# EAGLE schematic SDA381V5 (EAGLE 9.6.2)
Assembly variants: 75W, 150W
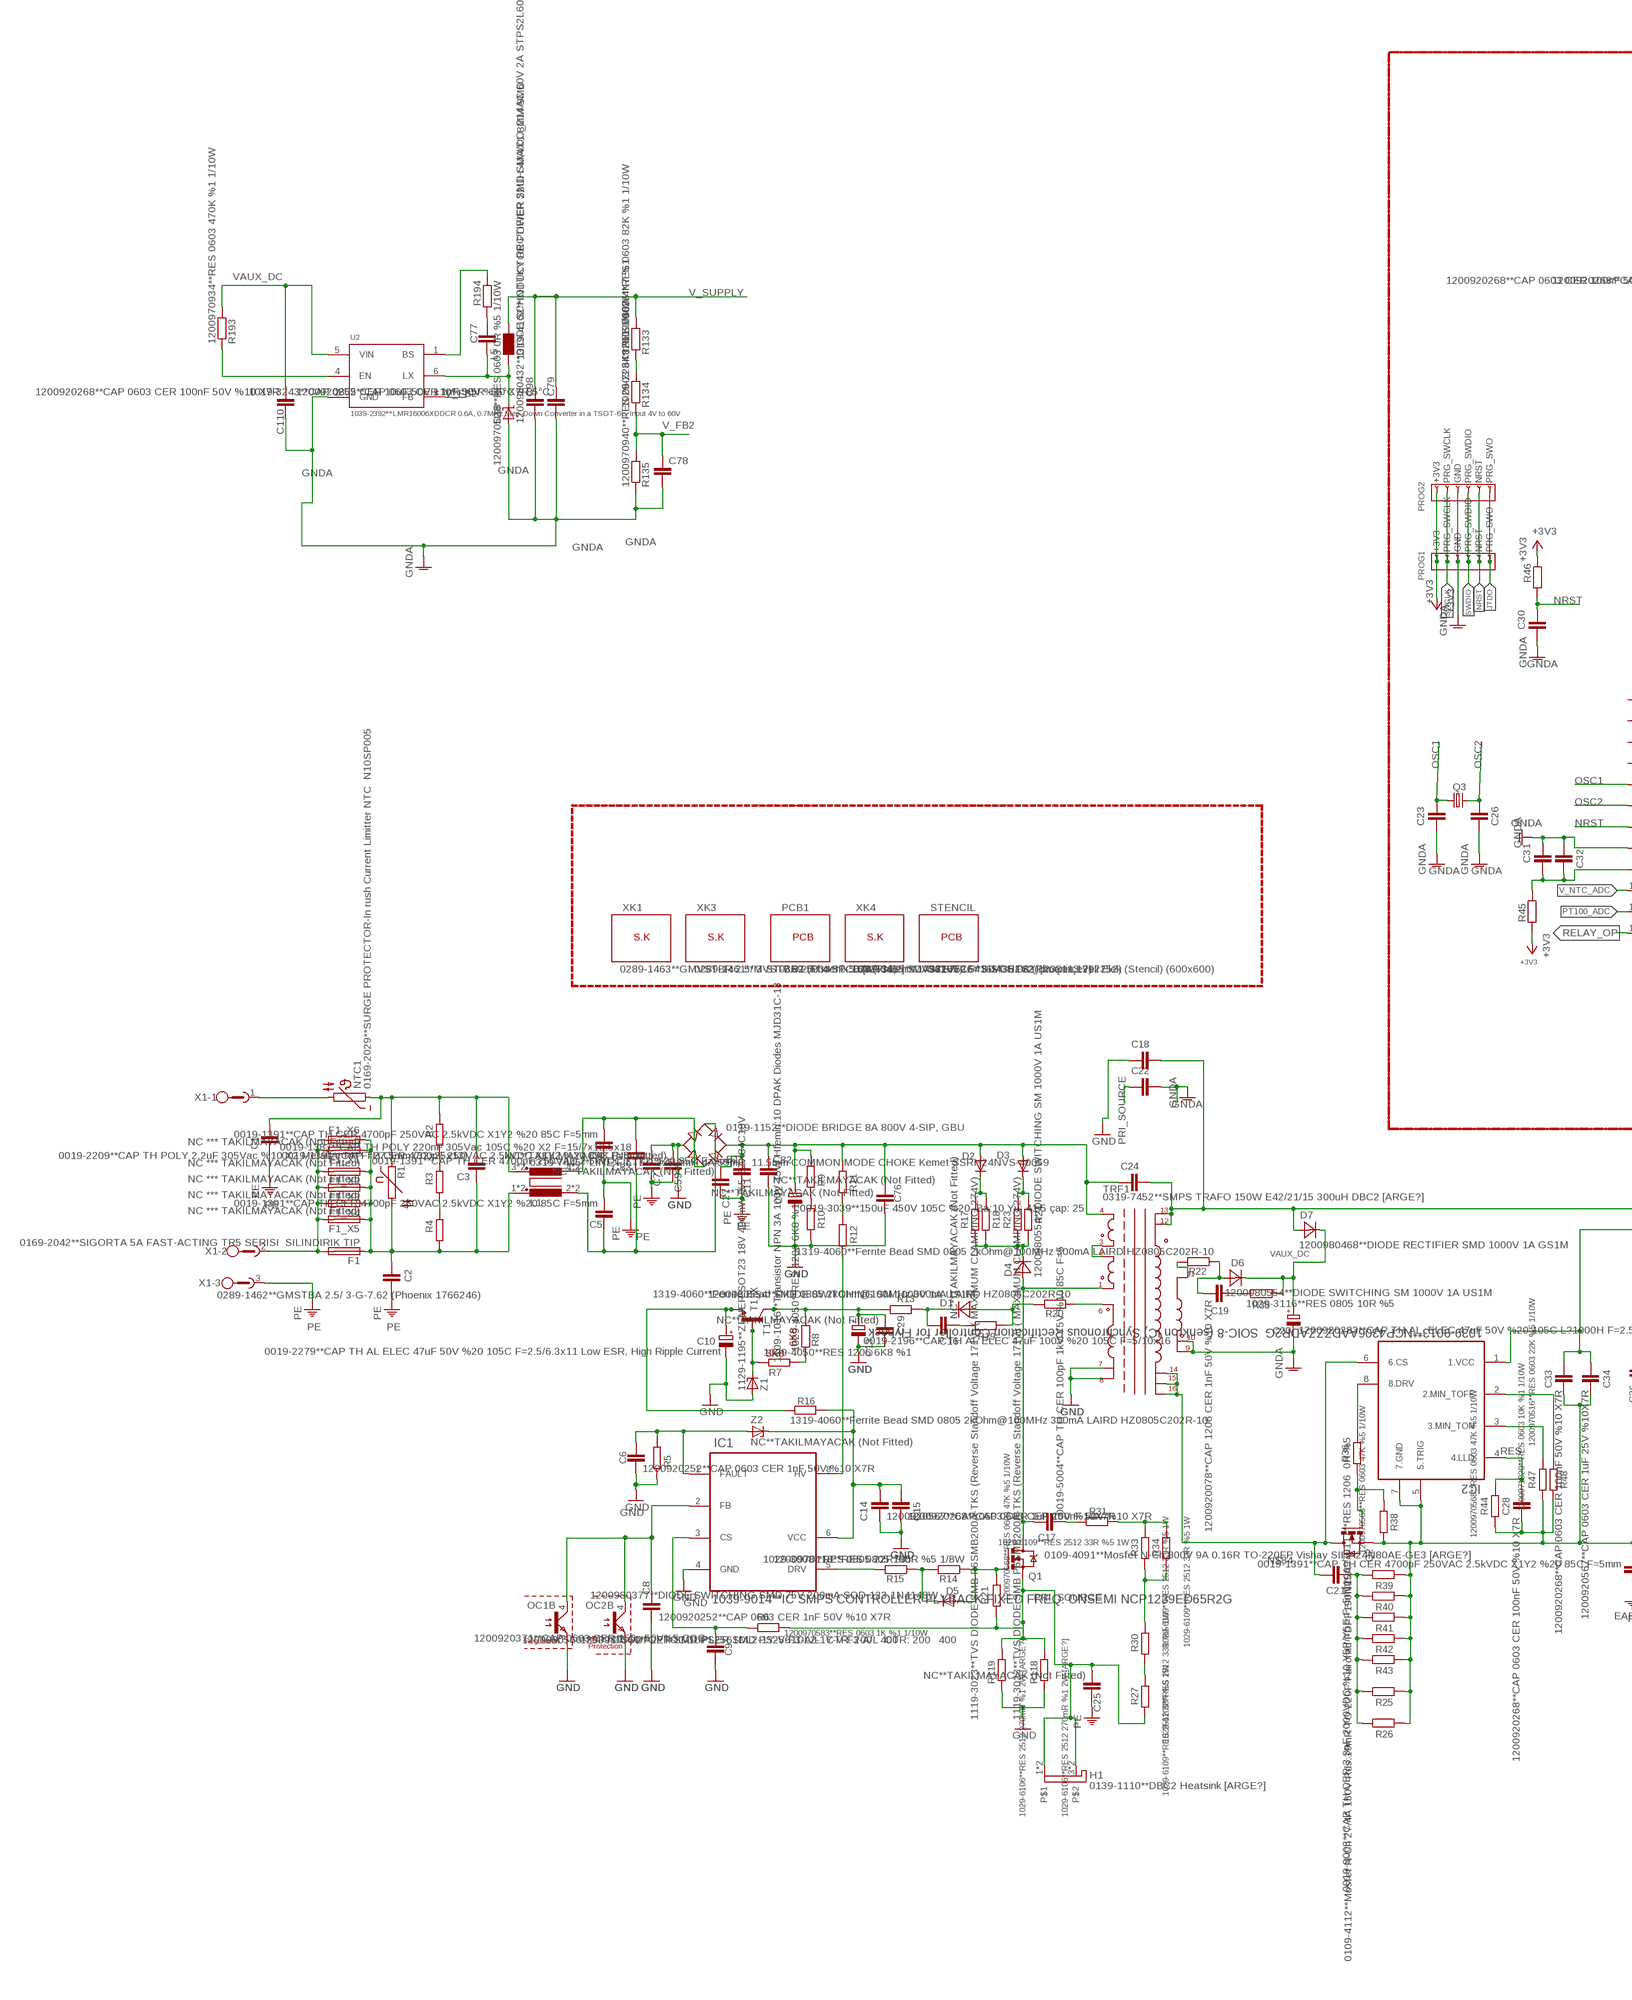
[diagram p0: schematic, sheet 1, part 1 of 2]
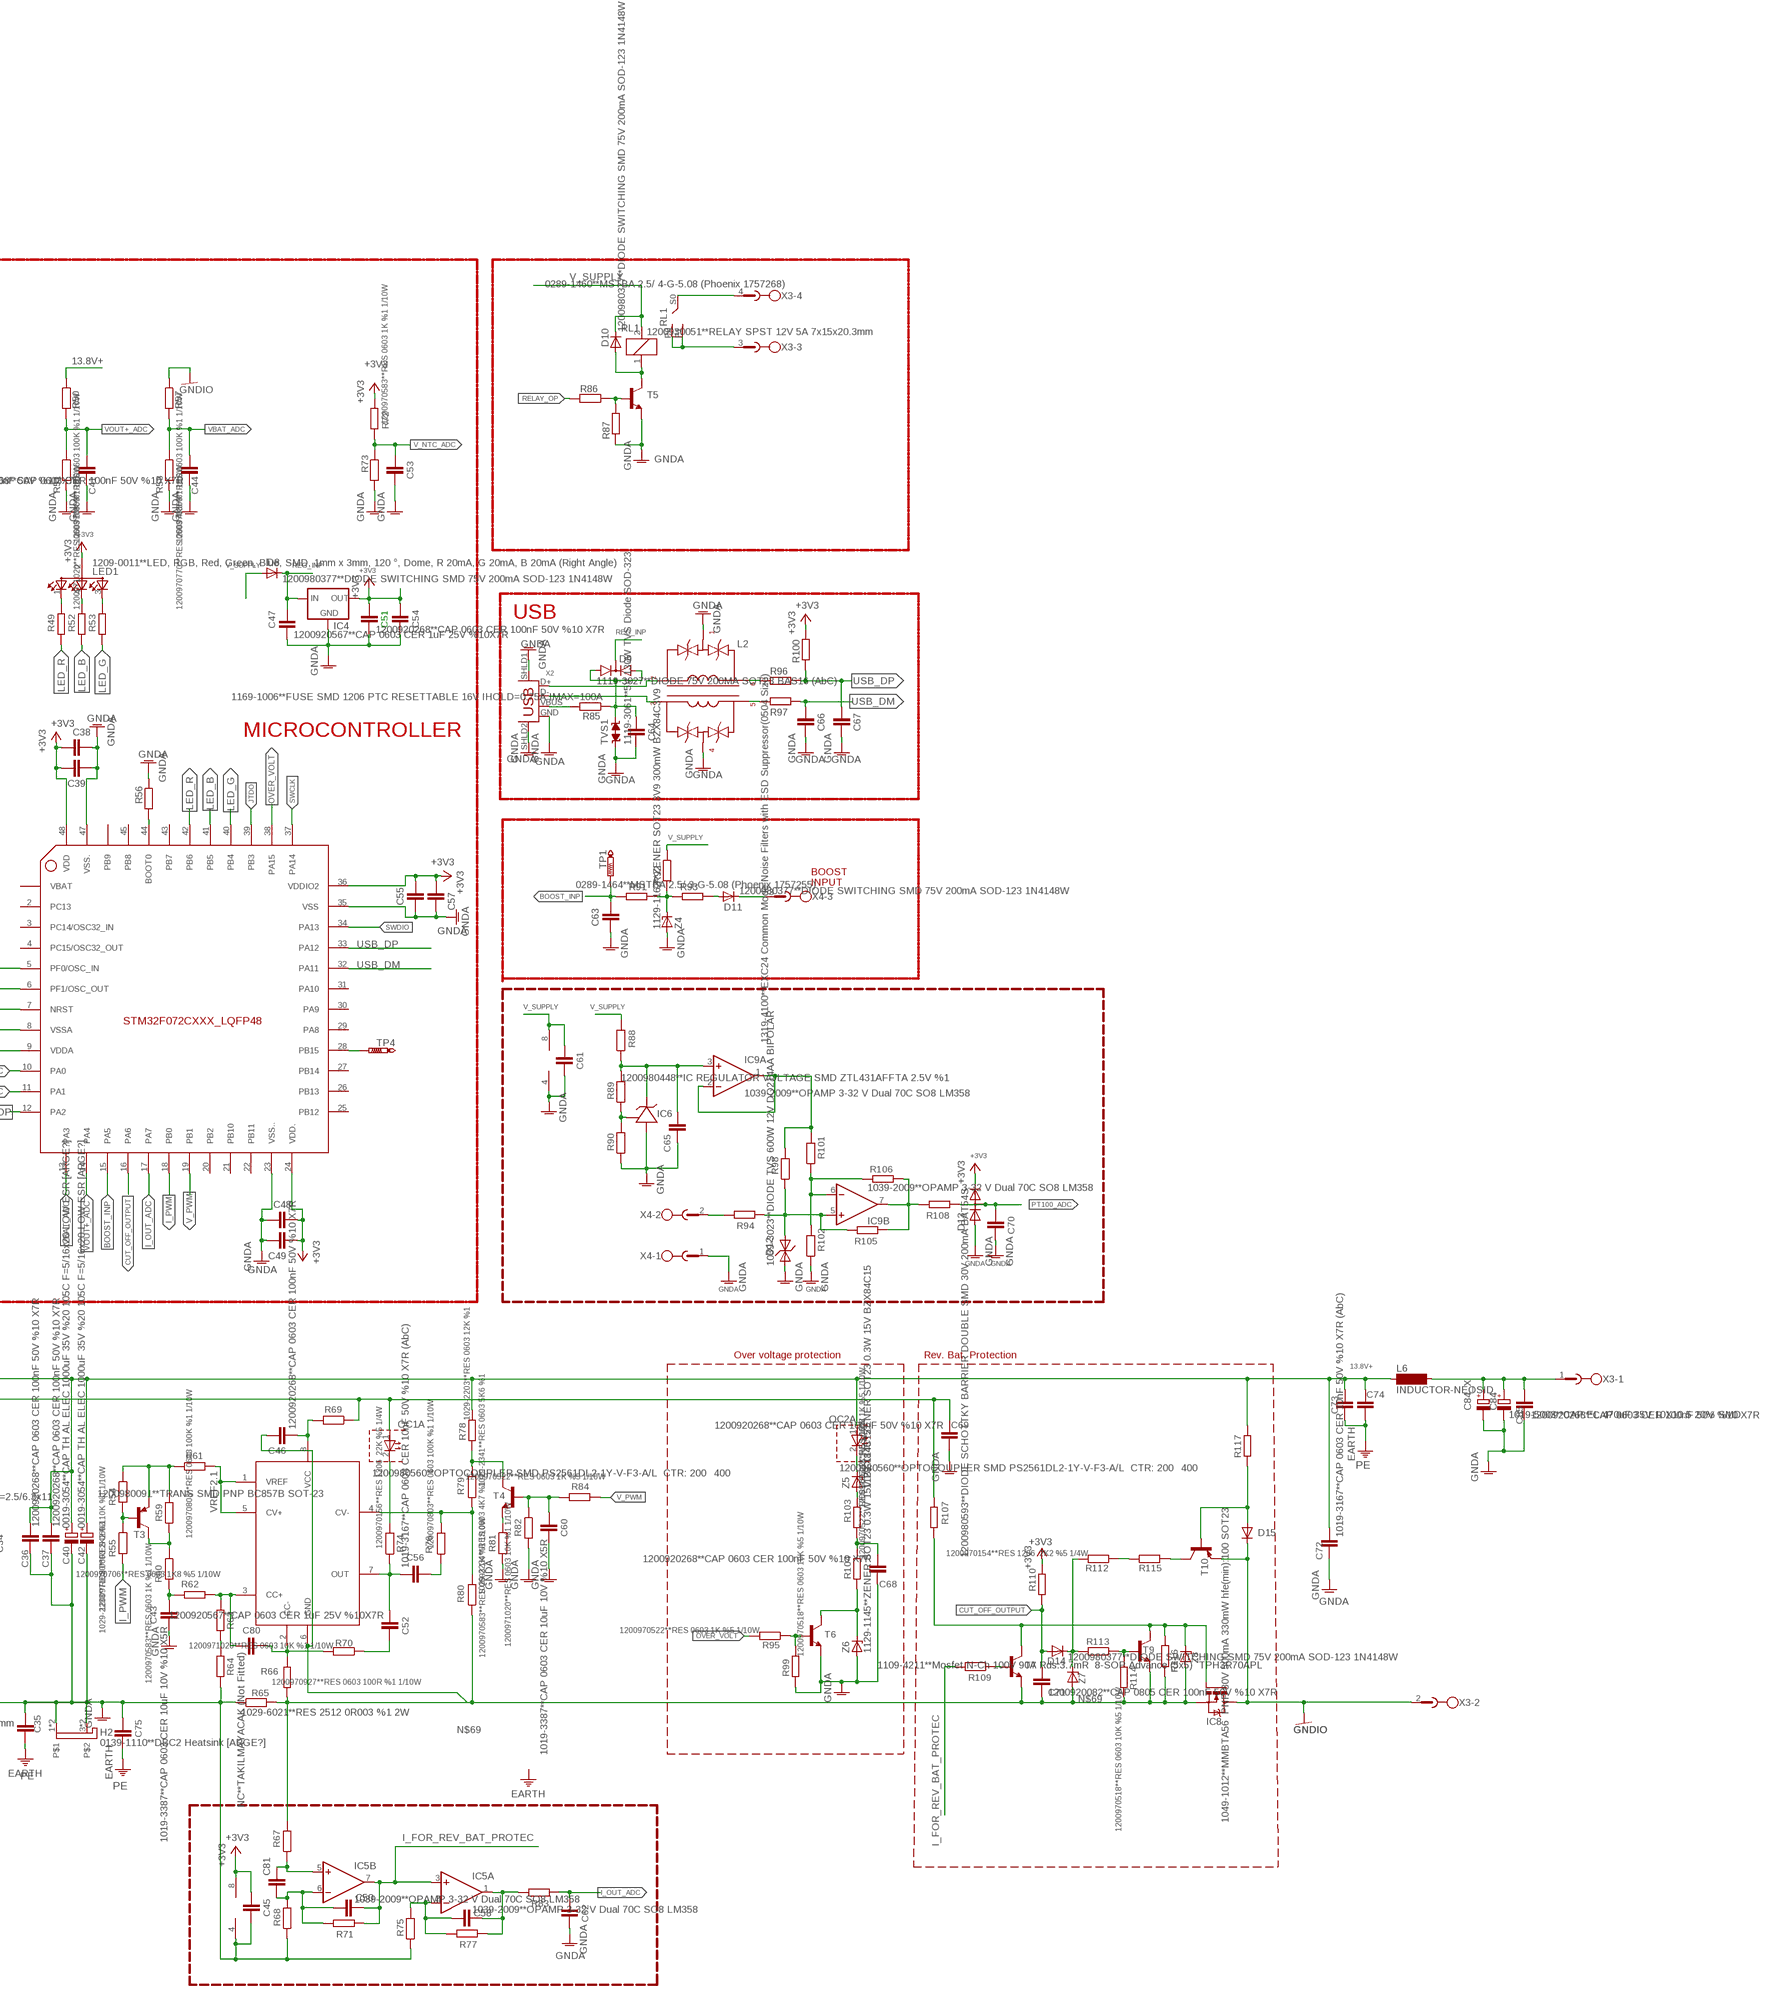
[diagram p1: schematic, sheet 1, part 2 of 2]

## Parts
B1  0119-1152**DIODE BRIDGE 8A 800V 4-SIP, GBU  DıODE_BRIDGE_8A_DIK  [DıODE_BRIDGE_8A_DIK]  (variant 75W: 0119-1171**KOPRU DIYOT MONOFAZ 4A 1000V KBL )
C1  NC**TAKILMAYACAK (Not Fitted)  C50-035X75  [C50-035X75]
C2  NC**TAKILMAYACAK (Not Fitted)  C50-035X75  [C50-035X75]
C3  0019-2209**CAP TH POLY 2.2uF 305Vac %10 X2 Metalize PP F=27.5mm (32x25x13)  C275-113X316_&_C150-072X183_&_C225-113X268  [C275-113X316_&_C150-072X183_&_C225-113X268]  (variant 75W: 0019-2207**CAP TH POLY 1uF 305Vac %10 X2 MKP F=22.5mm (12x22x26.5) )
C4  0019-1391**CAP TH CER 4700pF 250VAC 2.5kVDC X1Y2 %20 85C F=5mm  C50-035X75  [C50-035X75]  (variant 75W: 1200920292**CAP TH CER 2.2nF 300Vac %20 X1Y2 F=7.5mm DxS(13x5) )
C5  0019-1391**CAP TH CER 4700pF 250VAC 2.5kVDC X1Y2 %20 85C F=5mm  C50-035X75  [C50-035X75]  (variant 75W: 1200920292**CAP TH CER 2.2nF 300Vac %20 X1Y2 F=7.5mm DxS(13x5) )
C6  1200920252**CAP 0603 CER 1nF 50V %10 X7R  C-EUC0603E  [C0603_ENKO]  (variant 75W: 1200920252**CAP 0603 CER 1nF 50V %10 X7R )
C7  0019-1391**CAP TH CER 4700pF 250VAC 2.5kVDC X1Y2 %20 85C F=5mm  C50-035X75  [C50-035X75]  (variant 75W: 1200920292**CAP TH CER 2.2nF 300Vac %20 X1Y2 F=7.5mm DxS(13x5) )
C8  1200920252**CAP 0603 CER 1nF 50V %10 X7R  C-EUC0603E  [C0603_ENKO]  (variant 75W: 1200920252**CAP 0603 CER 1nF 50V %10 X7R )
C9  1200920371**CAP 0603 CER 150p 50V%5 COG  C-EUC0603E  [C0603_ENKO]
C10  0019-2279**CAP TH AL ELEC 47uF 50V %20 105C F=2.5/6.3x11 Low ESR, High Ripple Current  CPOL-EUE2.5-7  [E2,5-7]  (variant 75W: 0019-2279**CAP TH AL ELEC 47uF 50V %20 105C F=2.5/6.3x11 Low ESR, High Ripple Current )
C11  0019-1391**CAP TH CER 4700pF 250VAC 2.5kVDC X1Y2 %20 85C F=5mm  C50-035X75  [C50-035X75]  (variant 75W: 1200920292**CAP TH CER 2.2nF 300Vac %20 X1Y2 F=7.5mm DxS(13x5) )
C12  0019-3039**150uF 450V 105C %20 Ba:10 Yu: 41,5 çap: 25  CPOL-EUE10-25  [EB25D]  (variant 75W: 0019-3039**150uF 450V 105C %20 Ba:10 Yu: 41,5 çap: 25 )
C13  0019-2196**CAP TH AL ELEC 47uF 100V %20 105C F=5/10x16  CPOL-EUE5-10.5  [E5-10,5]
C14  1200920567**CAP 0603 CER 1uF 25V %10X7R  C-EUC0603E  [C0603_ENKO]  (variant 75W: 1200920567**CAP 0603 CER 1uF 25V %10X7R )
C15  1200920268**CAP 0603 CER 100nF 50V %10 X7R  C-EUC0603E  [C0603_ENKO]  (variant 75W: 1200920268**CAP 0603 CER 100nF 50V %10 X7R )
C16  NC**TAKILMAYACAK (Not Fitted)  C-EUC1206E  [C1206_ENKO]
C17  0019-5004**CAP TH CER 100pF 1kV Y5V %10 85C F=5  C075-32X103/C050-035X75  [C075-32X103/C050-035X75]  (variant 150W: 0019-1393**CAP TH CER 270pF 630V COG,NPO RADIAL %5 125C F=5mm )
C18  1200920292**CAP TH CER 2.2nF 300Vac %20 X1Y2 F=7.5mm DxS(13x5)  C075-32X103_DEIF  [C075-32X103_DEIF]
C19  1200920078**CAP 1206 CER 1nF 50V %10 X7R  C-EUC1206E  [C1206_ENKO]
C20  1200920283**CAP TH AL. ELEC 47uF 50V %20 105C L?1000H F=2.5/6.3x11  CPOL-EUE2.5-7  [E2,5-7]
C21  0019-3003**CAP TH CER 3.3nF 2000VDC %10 Y5P/Y5E F=5mm  C-EU050-045X075  [C050-045X075]  (variant 75W: 0019-1391**CAP TH CER 4700pF 250VAC 2.5kVDC X1Y2 %20 85C F=5mm )
C22  NC**TAKILMAYACAK (Not Fitted)  C075-32X103_DEIF  [C075-32X103_DEIF]
C23  1019-3352**CAP 0603 CER 22pF 50V %5 NPO  C-EUC0603E  [C0603_ENKO]
C24  NC**TAKILMAYACAK (Not Fitted)  C075-32X103_DEIF  [C075-32X103_DEIF]  (variant 150W: 1200920292**CAP TH CER 2.2nF 300Vac %20 X1Y2 F=7.5mm DxS(13x5) )
C25  NC**TAKILMAYACAK (Not Fitted)  C50-035X75  [C50-035X75]  (variant 150W: 0019-1391**CAP TH CER 4700pF 250VAC 2.5kVDC X1Y2 %20 85C F=5mm)
C26  1019-3352**CAP 0603 CER 22pF 50V %5 NPO  C-EUC0603E  [C0603_ENKO]
C27  NC**TAKILMAYACAK (Not Fitted)  C50-035X75  [C50-035X75]
C28  1200920268**CAP 0603 CER 100nF 50V %10 X7R  C-EUC0603E  [C0603_ENKO]
C29  NC**TAKILMAYACAK (Not Fitted)  C-EUC1206E  [C1206_ENKO]
C30  1200920268**CAP 0603 CER 100nF 50V %10 X7R  C-EUC0603E  [C0603_ENKO]
C31  1200920268**CAP 0603 CER 100nF 50V %10 X7R  C-EUC0603E  [C0603_ENKO]
C32  1019-3167**CAP 0603 CER 10nF 50V %10 X7R (AbC)  C-EUC0603E  [C0603_ENKO]
C33  1200920268**CAP 0603 CER 100nF 50V %10 X7R  C-EUC0603E  [C0603_ENKO]
C34  1200920567**CAP 0603 CER 1uF 25V %10X7R  C-EUC0603E  [C0603_ENKO]  (variant 75W: 1200920567**CAP 0603 CER 1uF 25V %10X7R )
C35  0019-1391**CAP TH CER 4700pF 250VAC 2.5kVDC X1Y2 %20 85C F=5mm  C-EU050-045X075  [C050-045X075]  (variant 75W: 0019-1391**CAP TH CER 4700pF 250VAC 2.5kVDC X1Y2 %20 85C F=5mm )
C36  1200920268**CAP 0603 CER 100nF 50V %10 X7R  C-EUC0603E  [C0603_ENKO]
C37  1200920268**CAP 0603 CER 100nF 50V %10 X7R  C-EUC0603E  [C0603_ENKO]
C38  1200920268**CAP 0603 CER 100nF 50V %10 X7R  C-EUC0603E  [C0603_ENKO]
C39  1019-3167**CAP 0603 CER 10nF 50V %10 X7R (AbC)  C-EUC0603E  [C0603_ENKO]
C40  0019-3054**CAP TH AL ELEC 1000uF 35V %20 105C F=5/16x20 LOW ESR [ARGE?]  E5-13/E7,5-16  [E5-13/E7,5-16]
C41  1200920268**CAP 0603 CER 100nF 50V %10 X7R  C-EUC0603E  [C0603_ENKO]
C42  0019-3054**CAP TH AL ELEC 1000uF 35V %20 105C F=5/16x20 LOW ESR [ARGE?]  CPOL-EUE5-13  [E5-13]
C43  1019-3387**CAP 0603 CER 10uF 10V %10 X5R  C-EUC0603E  [C0603_ENKO]
C44  1200920268**CAP 0603 CER 100nF 50V %10 X7R  C-EUC0603E  [C0603_ENKO]
C45  1200920268**CAP 0603 CER 100nF 50V %10 X7R  C-EUC0603E  [C0603_ENKO]
C46  1200920268**CAP 0603 CER 100nF 50V %10 X7R  C-EUC0603E  [C0603_ENKO]
C47  1200920567**CAP 0603 CER 1uF 25V %10X7R  C-EUC0603E  [C0603_ENKO]  (variant 75W: 1200920567**CAP 0603 CER 1uF 25V %10X7R )
C48  1019-3167**CAP 0603 CER 10nF 50V %10 X7R (AbC)  C-EUC0603E  [C0603_ENKO]
C49  1200920268**CAP 0603 CER 100nF 50V %10 X7R  C-EUC0603E  [C0603_ENKO]
C50  NC**TAKILMAYACAK (Not Fitted)  C-EUC0603E  [C0603_ENKO]
C51  1200920268**CAP 0603 CER 100nF 50V %10 X7R  C-EUC0603E  [C0603_ENKO]
C52  1200920567**CAP 0603 CER 1uF 25V %10X7R  C-EUC0603E  [C0603_ENKO]  (variant 75W: 1200920567**CAP 0603 CER 1uF 25V %10X7R )
C53  1200920268**CAP 0603 CER 100nF 50V %10 X7R  C-EUC0603E  [C0603_ENKO]
C54  1019-3301**CAP 0805 47uF 6.3V %20 X5R  C-EUC0805E  [C0805_ENKO]
C55  1019-3167**CAP 0603 CER 10nF 50V %10 X7R (AbC)  C-EUC0603E  [C0603_ENKO]
C56  1019-3167**CAP 0603 CER 10nF 50V %10 X7R (AbC)  C-EUC0603E  [C0603_ENKO]  (variant 75W: 1200920268**CAP 0603 CER 100nF 50V %10 X7R)
C57  1200920268**CAP 0603 CER 100nF 50V %10 X7R  C-EUC0603E  [C0603_ENKO]
C58  1200920371**CAP 0603 CER 150p 50V%5 COG  C-EUC0603E  [C0603_ENKO]
C59  NC**TAKILMAYACAK (Not Fitted)  C50-035X75  [C50-035X75]  (variant 150W: 0019-1391**CAP TH CER 4700pF 250VAC 2.5kVDC X1Y2 %20 85C F=5mm)
C60  1019-3387**CAP 0603 CER 10uF 10V %10 X5R  C-EUC0603E  [C0603_ENKO]
C61  1200920268**CAP 0603 CER 100nF 50V %10 X7R  C-EUC0603E  [C0603_ENKO]
C62  1200920268**CAP 0603 CER 100nF 50V %10 X7R  C-EUC0603E  [C0603_ENKO]
C63  1019-3167**CAP 0603 CER 10nF 50V %10 X7R (AbC)  C-EUC0603E  [C0603_ENKO]
C64  1200920268**CAP 0603 CER 100nF 50V %10 X7R  C-EUC0603E  [C0603_ENKO]
C65  1200920268**CAP 0603 CER 100nF 50V %10 X7R  C-EUC0603E  [C0603_ENKO]
C66  1019-3381**CAP 0603 CER 33pf 50V %5 NPO(COG)  C-EUC0603E  [C0603_ENKO]
C67  1019-3381**CAP 0603 CER 33pf 50V %5 NPO(COG)  C-EUC0603E  [C0603_ENKO]
C68  1200920268**CAP 0603 CER 100nF 50V %10 X7R  C-EUC0603E  [C0603_ENKO]
C69  1200920268**CAP 0603 CER 100nF 50V %10 X7R  C-EUC0603E  [C0603_ENKO]
C70  1200920268**CAP 0603 CER 100nF 50V %10 X7R  C-EUC0603E  [C0603_ENKO]
C71  1200920082**CAP 0805 CER 100nF 50V %10 X7R  C-EUC0805E  [C0805_ENKO]
C72  1019-3167**CAP 0603 CER 10nF 50V %10 X7R (AbC)  C-EUC0603E  [C0603_ENKO]
C73  0019-1391**CAP TH CER 4700pF 250VAC 2.5kVDC X1Y2 %20 85C F=5mm  C-EU050-035X075  [C050-035X075]  (variant 75W: 0019-1391**CAP TH CER 4700pF 250VAC 2.5kVDC X1Y2 %20 85C F=5mm )
C74  NC**TAKILMAYACAK (Not Fitted)  C-EU050-035X075  [C050-035X075]  (variant 75W: 0019-1391**CAP TH CER 4700pF 250VAC 2.5kVDC X1Y2 %20 85C F=5mm )
C75  NC**TAKILMAYACAK (Not Fitted)  C-EU050-035X075  [C050-035X075]  (variant 75W: 0019-1391**CAP TH CER 4700pF 250VAC 2.5kVDC X1Y2 %20 85C F=5mm )
C76  NC**TAKILMAYACAK (Not Fitted)  C065-052X106  [C065-052X106]  (variant 150W: 0019-1391**CAP TH CER 4700pF 250VAC 2.5kVDC X1Y2 %20 85C F=5mm)
C77  1200920268**CAP 0603 CER 100nF 50V %10 X7R  C-EUC0603E  [C0603_ENKO]
C78  1200920271**CAP 0603 CER 10pF 50V%10 COG  C-EUC0603E  [C0603_ENKO]
C79  1019-3243**CAP 0805 CER 10uF 50V ±10% X5R -55°C ~ 85°C  C-EUC0805E  [C0805_ENKO]
C80  NC**TAKILMAYACAK (Not Fitted)  C-EUC0603E  [C0603_ENKO]
C81  NC**TAKILMAYACAK (Not Fitted)  C-EUC0603E  [C0603_ENKO]
C82  NC**TAKILMAYACAK (Not Fitted)  C-EU150-091X182  [C150-091X182]
C83  0019-1383**CAP TH POLY 220nF 305Vac 105C %20 X2 F=15/7x13.5x18  C150-091X182_C225-108X268  [C150-091X182_C225-108X268]
C84  1019-5003**CAP.EL.470uF 35V 10X10.5 20% SMD  CPOL-EUE5-10.5  [E5-10,5]
C84_X  CPOL-EUE2.5-7  [E2,5-7]
C85  1200920268**CAP 0603 CER 100nF 50V %10 X7R  C-EUC0603E  [C0603_ENKO]
C98  1200920252**CAP 0603 CER 1nF 50V %10 X7R  C-EUC0603E  [C0603_ENKO]
C110  1200920268**CAP 0603 CER 100nF 50V %10 X7R  C-EUC0603E  [C0603_ENKO]
D1  1200980554**DIODE SWITCHING SM 1000V 1A US1M  M7_DC_DIYOT  [M7_DC_DIYOT]
D2  1119-3023**TVS DIODE SMB P6SMB200A-TKS (Reverse Standoff Voltage 171V) ( MAXIMUM CLAMPING 274V)  DIODE-SMB  [SMB]  (variant 75W: 0119-4002**TVS DIODE SMB 600W 160V (Reverse Standoff Voltage 136V) ( MAXIMUM CLAMPING VOLTAGE 219V) )
D3  1119-3023**TVS DIODE SMB P6SMB200A-TKS (Reverse Standoff Voltage 171V) ( MAXIMUM CLAMPING 274V)  DIODE-SMB  [SMB]  (variant 75W: 0119-4002**TVS DIODE SMB 600W 160V (Reverse Standoff Voltage 136V) ( MAXIMUM CLAMPING VOLTAGE 219V) )
D4  1200980554**DIODE SWITCHING SM 1000V 1A US1M  M7_DC_DIYOT  [M7_DC_DIYOT]
D5  1200980377**DIODE SWITCHING SMD 75V 200mA SOD-123 1N4148W  DIODE-SOD123  [SOD123]  (variant 75W: NC**AKILMAYACAK (Not Fitted))  (variant 150W: 1200980377**DIODE SWITCHING SMD 75V 200mA SOD-123 1N4148W )
D6  1200980554**DIODE SWITCHING SM 1000V 1A US1M  M7_DC_DIYOT  [M7_DC_DIYOT]
D7  1200980468**DIODE RECTIFIER SMD 1000V 1A GS1M  M7_DC_DIYOT  [M7_DC_DIYOT]
D8  1200980377**DIODE SWITCHING SMD 75V 200mA SOD-123 1N4148W  DIODE-SOD123  [SOD123]
D9  1119-3027**DIODE 75V 200MA SOT23 BAS16 (AbC)  DIODE-2AC|CASOT23  [SOT23]
D10  1200980377**DIODE SWITCHING SMD 75V 200mA SOD-123 1N4148W  DIODE-SOD123  [SOD123]
D11  1200980377**DIODE SWITCHING SMD 75V 200mA SOD-123 1N4148W  DIODE-SOD123  [SOD123]
D12  1039-3023**DIODE TVS 600W 12V DO214AA BIPOLAR  TRANSIL_SMB  [TRANSIL_SMB]
D13  1200980593**DIODE SCHOTTKY BARRIER DOUBLE SMD 30V 200mA BAT54S  BAV199  [SOT23]
D14  1200980377**DIODE SWITCHING SMD 75V 200mA SOD-123 1N4148W  DIODE-SOD123  [SOD123]
D15  1200980377**DIODE SWITCHING SMD 75V 200mA SOD-123 1N4148W  DIODE-SOD123  [SOD123]
D18  1200980432**DIODE SCHOTTKY RECTIFIER SMD SMA/DO_214AC 60V 2A STPS2L60A  SD-SMA  [SMA]
F1  0169-2042**SIGORTA 5A FAST-ACTING TR5 SERISI SILINDIRIK TIP  SENS_FUSE  [SENS_FUSE]
F1_X1  NC *** TAKILMAYACAK (Not Fitted)  FUSE_0678D  [FUSE_0678D]
F1_X2  NC *** TAKILMAYACAK (Not Fitted)  FUSE_1025FA  [FUSE_1025FA]
F1_X3  NC *** TAKILMAYACAK (Not Fitted)  FUSE_EBF_FUSE_446/447  [FUSE_EBF_FUSE_446/447]
F1_X4  NC *** TAKILMAYACAK (Not Fitted)  FUSE_OMF250  [FUSE_OMF250]
F1_X5  NC *** TAKILMAYACAK (Not Fitted)  FUSE_UMF250  [FUSE_UMF250]
F1_X6  FUSE_TYPE0679H  [FUSE_TYPE0679H]
H1  0139-1110**DBC2 Heatsink [ARGE?]  DEIF_SOGUTUCU_2  [DEIF_SOGUTUCU_2]
H2  0139-1110**DBC2 Heatsink [ARGE?]  DEIF_SOGUTUCU_2  [DEIF_SOGUTUCU_2]
IC1  1039-9014**IC SMPS CONTROLLER FLYBACK FIXED FREQ. ONSEMI NCP1239ED65R2G  NCP1239_SMPS_IC  [NCP1239_SMPS_IC]
IC2  1039-9013**NCP4306AADZZZADR2G SOIC-8 (senkron IC) Synchronous Rectification Controller for Flyback  NCP4306  [NCP4306]
IC3  1039-2224**TSM1011ID SO-8 Constant Voltage and Constant Current Controller  TSM1011  [SO-8]
IC4  1039-3003**Voltage Regulator SOT-89 3.3V Diodes AP2204RA-3.3TRG1  S-812XSGUP  [SOT89]
IC5  1039-2009**OPAMP 3-32 V Dual 70C SO8 LM358  LM358D  [SO08]
IC6  1200980448**IC REGULATOR VOLTAGE SMD ZTL431AFFTA 2.5V %1  TL431_SOT23F  [TL431_SOT23F]
IC8  1109-4211**Mosfet N-Ch 100V 90A Rds:3.7mR 8-SOP Advance (5x5) TPH3R70APL  TPH6R30ANL  [TPH6R30ANL]
IC9  1039-2009**OPAMP 3-32 V Dual 70C SO8 LM358  LM358D  [SO08]
L1  0319-7445**LINE FILTER 2x5,9mH 4A 55mR 11.5mm COMMON MODE CHOKE Kemet SSRH24NVS-40059  UU1620_&_FWCMET24V  [UU1620_&_FWCMET24V]  (variant 75W: 0319-5030**LINE FILTER 2x7mH 1,5A COMMON MODE CHOKE (UU1620) )
L2  1319-4100**EXC24 Common Mode Noise Filters with ESD Suppressor(0504 Size)  EXC24CS_COMMON_MODE  [EXC24CS_COMMON_MODE]
L5  1319-4102**INDUCTOR POWER 22UH 4X4X1.8MM SMD  WE-PD2WE_PD2_5MM  [WE-PD2_5MM]
L6  INDUCTOR-NEOSID  [INDUCTOR-NEOSID]
LED1  1209-0011**LED, RGB, Red, Green, Blue, SMD, 1mm x 3mm, 120 °, Dome, R 20mA, G 20mA, B 20mA (Right Angle)  KPFA-3010RGBC-11  [KPFA-3010RGBC-11]
NTC1  0169-2029**SURGE PROTECTOR-In rush Current Limitter NTC N10SP005  NTC_15R_2A_&_N15SP005-5  [NTC_15R_2A_&_N15SP005-5]
OC1  1200980560**OPTOCOUPLER SMD PS2561DL2-1Y-V-F3-A/L CTR: 200˜400  PS2561DL2-1_OPTO1  [PS2561DL2-1_OPTO1]
OC2  1200980560**OPTOCOUPLER SMD PS2561DL2-1Y-V-F3-A/L CTR: 200˜400  PS2561DL2-1_OPTO1  [PS2561DL2-1_OPTO1]
PCB1  0369-5034**PCB [ARGE?] SDA381V2CF416M3HFS2(123x113.2)  PCB  [PCB]
PROG1  NC**TAKILMAYACAK (Not Fitted)  PROG_6PIN  [PROG_6PIN]
PROG2  NC**TAKILMAYACAK (Not Fitted)  PROG_6PIN  [PROG_6PIN]
Q1  0109-4091**Mosfet N-Ch 800V 9A 0.16R TO-220FP Vishay SIHA24N80AE-GE3 [ARGE?]  STP5NA50  [TO220BV]
Q2  0109-4112**Mosfet N-Ch 27.4A 150V Rds:19mR TO-220F Fairchild FDPF190N15A  STP5NA50  [TO220BV]
Q3  1149-0006**HC49S SMD KRISTAL 8MHZ -40+85 20PF 50PPM FAT Y3MM  CRYSTALHC49UP  [HC49UP]
R1  0169-2013**Varistor 20mm 300V  S20K40  [S20K40]
R2  1200970587**RES 1206 470K %5 1/4W  R-EU_R1206E  [R1206_ENKO]
R3  1200970587**RES 1206 470K %5 1/4W  R-EU_R1206E  [R1206_ENKO]
R4  1200970587**RES 1206 470K %5 1/4W  R-EU_R1206E  [R1206_ENKO]
R5  1200970687**RES 0603 56K %1 1/10W  R-EU_R0603E  [R0603_ENKO]
R6  1200970583**RES 0603 1K %1 1/10W  R-EU_R0603E  [R0603_ENKO]
R7  1029-4050**RES 1206 6K8 %1  R-EU_R1206E  [R1206_ENKO]
R8  1029-4050**RES 1206 6K8 %1  R-EU_R1206E  [R1206_ENKO]
R9  1200970179**RES 1206 330K %5 1/4W  R-EU_R1206E  [R1206_ENKO]  (variant 75W: NC**TAKILMAYACAK (Not Fitted))
R10  1200970179**RES 1206 330K %5 1/4W  R-EU_R1206E  [R1206_ENKO]  (variant 75W: NC**TAKILMAYACAK (Not Fitted))
R11  1200970154**RES 1206 2K2 %5 1/4W  R-EU_R1206E  [R1206_ENKO]
R12  1200970154**RES 1206 2K2 %5 1/4W  R-EU_R1206E  [R1206_ENKO]
R13  1200970601**RES 1206 10R %5 1/4W  R-EU_R1206E  [R1206_ENKO]
R14  1200970118**RES 0805 100R %5 1/8W  R-EU_R0805E  [R0805_ENKO]  (variant 150W: 1029-6071**RES 0805 82R %1)
R15  1029-3008**RES 0805 22R %5  R-EU_R0805E  [R0805_ENKO]  (variant 150W: 1029-3416**RES 0805 47R %1 (AbC) (MX322))
R16  1319-4060**Ferrite Bead SMD 0805 2kOhm@100MHz 300mA LAIRD HZ0805C202R-10  R-EU_R0805E  [R0805_ENKO]
R17  1029-3146**RES 1206 7R68 %1  R-EU_R1206E  [R1206_ENKO]
R18  1029-3146**RES 1206 7R68 %1  R-EU_R1206E  [R1206_ENKO]
R19  NC**TAKILMAYACAK (Not Fitted)  R-EU_R1206E  [R1206_ENKO]
R20  1319-4060**Ferrite Bead SMD 0805 2kOhm@100MHz 300mA LAIRD HZ0805C202R-10  R-EU_R0805E  [R0805_ENKO]
R21  1200970568**RES 0603 47K %5 1/10W  R-EU_R0603E  [R0603_ENKO]
R22  1319-4060**Ferrite Bead SMD 0805 2kOhm@100MHz 300mA LAIRD HZ0805C202R-10  R-EU_R0805E  [R0805_ENKO]
R23  1029-3146**RES 1206 7R68 %1  R-EU_R1206E  [R1206_ENKO]
R24  1029-3146**RES 1206 7R68 %1  R-EU_R1206E  [R1206_ENKO]
R25  1200970228**RES 1206 47R %5 1/4W  R-EU_R1206E  [R1206_ENKO]
R26  1200970228**RES 1206 47R %5 1/4W  R-EU_R1206E  [R1206_ENKO]
R27  1029-6109**RES 2512 33R %5 1W  R-EU_R2512  [R2512]
R30  1029-6109**RES 2512 33R %5 1W  R-EU_R2512  [R2512]  (variant 150W: 1029-6114**RES 2512 15R %5 1W)
R31  1029-6109**RES 2512 33R %5 1W  R-EU_R2512  [R2512]  (variant 150W: 1029-6114**RES 2512 15R %5 1W)
R33  1029-6109**RES 2512 33R %5 1W  R-EU_R2512  [R2512]  (variant 150W: 1029-6114**RES 2512 15R %5 1W)
R34  1029-6109**RES 2512 33R %5 1W  R-EU_R2512  [R2512]  (variant 150W: 1029-6114**RES 2512 15R %5 1W)
R35  1029-3116**RES 0805 10R %5  R-EU_R0805E  [R0805_ENKO]
R36  1200970117**RES 1206 0R %5  R-EU_R1206E  [R1206_ENKO]
R38  1200970568**RES 0603 47K %5 1/10W  R-EU_R0603E  [R0603_ENKO]
R39  1200970228**RES 1206 47R %5 1/4W  R-EU_R1206E  [R1206_ENKO]  (variant 75W: 1200970119**RES 1206 100R %5 1/4W)  (variant 150W: NC**TAKILMAYACAK (Not Fitted) )
R40  1200970228**RES 1206 47R %5 1/4W  R-EU_R1206E  [R1206_ENKO]  (variant 75W: 1200970119**RES 1206 100R %5 1/4W)  (variant 150W: 1200970554**RES 1206 56R %1 1/4W)
R41  1200970228**RES 1206 47R %5 1/4W  R-EU_R1206E  [R1206_ENKO]  (variant 75W: 1200970119**RES 1206 100R %5 1/4W)  (variant 150W: 1200970554**RES 1206 56R %1 1/4W)
R42  1200970228**RES 1206 47R %5 1/4W  R-EU_R1206E  [R1206_ENKO]  (variant 75W: 1200970119**RES 1206 100R %5 1/4W)  (variant 150W: 1200970554**RES 1206 56R %1 1/4W)
R43  1200970228**RES 1206 47R %5 1/4W  R-EU_R1206E  [R1206_ENKO]  (variant 75W: 1200970228**RES 1206 47R %5 1/4W)  (variant 150W: 1200970554**RES 1206 56R %1 1/4W)
R44  1200970568**RES 0603 47K %5 1/10W  R-EU_R0603E  [R0603_ENKO]
R45  1319-4060**Ferrite Bead SMD 0805 2kOhm@100MHz 300mA LAIRD HZ0805C202R-10  R-EU_R0805E  [R0805_ENKO]
R46  1200970518**RES 0603 10K %5 1/10W  R-EU_R0603E  [R0603_ENKO]
R47  1200971020**RES 0603 10K %1 1/10W  R-EU_R0603E  [R0603_ENKO]
R48  1200970516**RES 0603 22K %5 1/10W  R-EU_R0603E  [R0603_ENKO]  (variant 75W: 1200970516**RES 0603 22K %5 1/10W)
R49  1029-2005**RES 0603 220R %1  R-EU_R0603E  [R0603_ENKO]
R50  1200970803**RES 0603 100K %1 1/10W  R-EU_R0603E  [R0603_ENKO]
R51  1200971020**RES 0603 10K %1 1/10W  R-EU_R0603E  [R0603_ENKO]
R52  1029-2005**RES 0603 220R %1  R-EU_R0603E  [R0603_ENKO]
R53  1029-2005**RES 0603 220R %1  R-EU_R0603E  [R0603_ENKO]
R54  1200971020**RES 0603 10K %1 1/10W  R-EU_R0603E  [R0603_ENKO]
R55  1029-2233**RES 0603 2K2 %1  R-EU_R0603E  [R0603_ENKO]
R56  1200970522**RES 0603 1K %5 1/10W  R-EU_R0603E  [R0603_ENKO]
R57  1200970803**RES 0603 100K %1 1/10W  R-EU_R0603E  [R0603_ENKO]
R58  1200970770**RES 0603 4K3 %1 1/10W  R-EU_R0603E  [R0603_ENKO]
R59  1200970803**RES 0603 100K %1 1/10W  R-EU_R0603E  [R0603_ENKO]
R60  1200970583**RES 0603 1K %1 1/10W  R-EU_R0603E  [R0603_ENKO]
R61  1200970583**RES 0603 1K %1 1/10W  R-EU_R0603E  [R0603_ENKO]
R62  1200970706**RES 0603 1K8 %5 1/10W  R-EU_R0603E  [R0603_ENKO]
R63  1029-2003**RES 0603 10R %1  R-EU_R0603E  [R0603_ENKO]  (variant 75W: 1200970927**RES 0603 100R %1 1/10W )
R64  1029-2006**RES 0603 47R %1  R-EU_R0603E  [R0603_ENKO]  (variant 75W: 1200970528**RES 0603 0R %5 1/10W )
R65  1029-6021**RES 2512 0R003 %1 2W  R-EU_R2512  [R2512]  (variant 75W: 1029-6014**RES 2512 0R010 %1 1W )
R66  1200970927**RES 0603 100R %1 1/10W  R-EU_R0603E  [R0603_ENKO]  (variant 75W: 1200970927**RES 0603 100R %1 1/10W )
R67  1200970522**RES 0603 1K %5 1/10W  R-EU_R0603E  [R0603_ENKO]
R68  1200970522**RES 0603 1K %5 1/10W  R-EU_R0603E  [R0603_ENKO]
R69  1029-3116**RES 0805 10R %5  R-EU_R0805E  [R0805_ENKO]  (variant 75W: 1029-2003**RES 0603 10R %1 )
R70  1200971020**RES 0603 10K %1 1/10W  R-EU_R0603E  [R0603_ENKO]
R71  1029-2234**RES 0603 4K7 %1  R-EU_R0603E  [R0603_ENKO]  (variant 75W: 1029-2233**RES 0603 2K2 %1 )
R72  1200970583**RES 0603 1K %1 1/10W  R-EU_R0603E  [R0603_ENKO]
R73  1169-1001**TSM2A103F3951RZ THINKING 0805 10K NTC 125C  R-EU_R0805E  [R0805_ENKO]
R74  1200970156**RES 1206 22K %5 1/4W  R-EU_R1206E  [R1206_ENKO]
R75  1200970583**RES 0603 1K %1 1/10W  R-EU_R0603E  [R0603_ENKO]
R76  1200970803**RES 0603 100K %1 1/10W  R-EU_R0603E  [R0603_ENKO]
R77  1029-6089**RES 0603 6K8 %5  R-EU_R0603E  [R0603_ENKO]
R78  1029-2203**RES 0603 12K %1  R-EU_R0603E  [R0603_ENKO]
R79  1029-2341**RES 0603 5K6 %1  R-EU_R0603E  [R0603_ENKO]  (variant 75W: 1200970707**RES 0603 5K6 %5 1/10W )
R80  1029-2234**RES 0603 4K7 %1  R-EU_R0603E  [R0603_ENKO]
R81  1200970583**RES 0603 1K %1 1/10W  R-EU_R0603E  [R0603_ENKO]  (variant 75W: 1029-6089**RES 0603 6K8 %5)
R82  1200971020**RES 0603 10K %1 1/10W  R-EU_R0603E  [R0603_ENKO]
R83  1200970522**RES 0603 1K %5 1/10W  R-EU_R0603E  [R0603_ENKO]
R84  1200970522**RES 0603 1K %5 1/10W  R-EU_R0603E  [R0603_ENKO]
R85  1169-1006**FUSE SMD 1206 PTC RESETTABLE 16V IHOLD=0.75A IMAX=100A  R-EU_R1206E  [R1206_ENKO]
R86  1200970522**RES 0603 1K %5 1/10W  R-EU_R0603E  [R0603_ENKO]
R87  1200970518**RES 0603 10K %5 1/10W  R-EU_R0603E  [R0603_ENKO]
R88  1029-2234**RES 0603 4K7 %1  R-EU_R0603E  [R0603_ENKO]
R89  1200970583**RES 0603 1K %1 1/10W  R-EU_R0603E  [R0603_ENKO]
R90  1029-2231**RES 0603 1K8 %1  R-EU_R0603E  [R0603_ENKO]
R91  1200970518**RES 0603 10K %5 1/10W  R-EU_R0603E  [R0603_ENKO]
R92  1200970568**RES 0603 47K %5 1/10W  R-EU_R0603E  [R0603_ENKO]
R93  1409-0025**RES 0603 470R %5 1/16W  R-EU_R0603E  [R0603_ENKO]
R94  1029-6086**RES 0603 22R %1  R-EU_R0603E  [R0603_ENKO]
R95  1200970522**RES 0603 1K %5 1/10W  R-EU_R0603E  [R0603_ENKO]
R96  1029-6086**RES 0603 22R %1  R-EU_R0603E  [R0603_ENKO]
R97  1029-6086**RES 0603 22R %1  R-EU_R0603E  [R0603_ENKO]
R98  1029-2234**RES 0603 4K7 %1  R-EU_R0603E  [R0603_ENKO]
R99  1200970518**RES 0603 10K %5 1/10W  R-EU_R0603E  [R0603_ENKO]
R100  1200970852**RES 0603 1K5 %5 1/10W ( <-1029-3501 )  R-EU_R0603E  [R0603_ENKO]
R101  1200970684**RES 0603 47K %1 1/10W  R-EU_R0603E  [R0603_ENKO]
R102  1200970583**RES 0603 1K %1 1/10W  R-EU_R0603E  [R0603_ENKO]
R103  1200970522**RES 0603 1K %5 1/10W  R-EU_R0603E  [R0603_ENKO]
R104  1200970522**RES 0603 1K %5 1/10W  R-EU_R0603E  [R0603_ENKO]
R105  1029-2229**RES 0603 120K %1  R-EU_R0603E  [R0603_ENKO]
R106  1029-2219**RES 0603 30K %1  R-EU_R0603E  [R0603_ENKO]
R107  1200970515**RES 0603 100K %5 1/10W  R-EU_R0603E  [R0603_ENKO]
R108  1200970730**RES 0603 560R %1 1/10W  R-EU_R0603E  [R0603_ENKO]
R109  1200970518**RES 0603 10K %5 1/10W  R-EU_R0603E  [R0603_ENKO]
R110  1200970516**RES 0603 22K %5 1/10W  R-EU_R0603E  [R0603_ENKO]
R112  1200970154**RES 1206 2K2 %5 1/4W  R-EU_R1206E  [R1206_ENKO]
R113  1200970121**RES 0805 1K %5 1/8W  R-EU_R0805E  [R0805_ENKO]
R114  1200970518**RES 0603 10K %5 1/10W  R-EU_R0603E  [R0603_ENKO]
R115  1200970853**RES 1206 39K %1 1/4W  R-EU_R1206E  [R1206_ENKO]
R116  1200970585**RES 0603 1M %5 1/10W  R-EU_R0603E  [R0603_ENKO]
R117  1029-6015**RES 1206 56K %5  R-EU_R1206E  [R1206_ENKO]
R118  1029-6106**RES 2512 270mR %1 2W [ARGE?]  R-EU_R2512  [R2512]  (variant 75W: 1029-6105**RES 2512 360mR %5 1W [ARGE?])
R119  1029-6106**RES 2512 270mR %1 2W [ARGE?]  R-EU_R2512  [R2512]  (variant 75W: 1029-6105**RES 2512 360mR %5 1W [ARGE?])
R133  1200970626**RES 0603 82K %1 1/10W  R-EU_R0603E  [R0603_ENKO]
R134  1029-2234**RES 0603 4K7 %1  R-EU_R0603E  [R0603_ENKO]
R135  1200970940**RES 0603 6K8 %1 1/10W  R-EU_R0603E  [R0603_ENKO]
R193  1200970934**RES 0603 470K %1 1/10W  R-EU_R0603E  [R0603_ENKO]
R194  1200970528**RES 0603 0R %5 1/10W  R-EU_R0603E  [R0603_ENKO]  (variant 75W: 1200970528**RES 0603 0R %5 1/10W )
RL1  1200930051**RELAY SPST 12V 5A 7x15x20.3mm  ALD1_AND_ALJ_RELAY  [ALD1_AND_ALJ_RELAY]
STENCIL  041-7516**SDA381V2 için Çerçeveli Elek (Stencil) (600x600)  PCB  [PCB]
T1  1109-1016**Transistor NPN 3A 100V 15W Hfemin:10 DPAK Diodes MJD31C-13  MJD31C  [DPAK]
T1_X  1200980090**TRANS SMD NPN BC847B SOT-23  BC848ALT1SMD  [SOT23]
T3  1200980091**TRANS SMD PNP BC857B SOT-23  BC856B-PNP-SOT23-BEC  [SOT23-BEC]
T4  1200980090**TRANS SMD NPN BC847B SOT-23  BC848ALT1SMD  [SOT23]
T5  1200980090**TRANS SMD NPN BC847B SOT-23  BC848ALT1SMD  [SOT23]
T6  1200980090**TRANS SMD NPN BC847B SOT-23  BC848ALT1SMD  [SOT23]
T7  1200980090**TRANS SMD NPN BC847B SOT-23  BC848ALT1SMD  [SOT23]
T9  1200980090**TRANS SMD NPN BC847B SOT-23  BC848ALT1SMD  [SOT23]
T10  1049-1012**MMBTA56 PNP 80V 500mA 330mW hfe(min):100 SOT23  BC856B-PNP-SOT23-BEC  [SOT23-BEC]
TP1  PTR1TP20R  [TP20R]
TP4  PTR1TP20R  [TP20R]
TRF1  0319-7452**SMPS TRAFO 150W E42/21/15 300uH DBC2 [ARGE?]  DEIF_TRF  [DEIF_TRF]  (variant 75W: 0319-7451**SMPS TRAFO 90W E36/18/11 2*60uH DBC2 [ARGE?] )
TVS1  1119-3061**5V 130W TVS Diode SOD-323  TVS-BD-SOD323  [SOD323]
U1  1039-2220**STM32F072C8T6 64K Flash USB, CAN  STM32F072CXXX_LQFP48  [STM32F072CXXX_LQFP48]
U2  1039-2392**LMR16006XDDCR 0.6A, 0.7MHz Step-Down Converter in a TSOT-6L, Input 4V to 60V  AOZ1282CI-1  [AOZ1282CI-1]
X1  0289-1462**GMSTBA 2.5/ 3-G-7.62 (Phoenix 1766246)  GMSTBA3  [GMSTBA3]
X2  0309-1064**USB Type-B Mini Connector Horizantal  USB_B(YATIK)  [USB_B(YATIK)]
X3  0289-1460**MSTBA 2.5/ 4-G-5.08 (Phoenix 1757268)  MSTBA4  [MSTBA4]
X4  0289-1464**MSTBA 2.5/ 3-G-5.08 (Phoenix 1757255)  MSTBA3  [MSTBA3]
XK1  0289-1463**GMVSTBR 2.5/ 3-ST-7.62 (Phoenix 1832536)  SOKET  [SOKET]
XK3  0289-1461**MVSTBR 2.5/ 4-ST-5.08 (Phoenix 1792265)  SOKET  [SOKET]
XK4  0289-1465**MVSTBR 2.5/ 3-ST-5.08 (Phoenix 1792252)  SOKET  [SOKET]
Z1  1129-1195**ZENER SOT23 18V 400mW %5 BZX84C18V  ZENER-DIODESOT23  [SOT23]
Z2  NC**TAKILMAYACAK (Not Fitted)  ZENER-DIODESOT23  [SOT23]
Z4  1129-1162**ZENER SOT23 3V9 300mW BZX84C3V9  ZENER-DIODESOT23  [SOT23]
Z5  1129-1145**ZENER SOT23 0.3W 15V BZX84C15  ZENER-DIODESOT23  [SOT23]
Z6  1129-1145**ZENER SOT23 0.3W 15V BZX84C15  ZENER-DIODESOT23  [SOT23]
Z7  1129-1151**ZENER SOT23 12V 225mW BZX84C12  ZENER-DIODESOT23  [SOT23]
Z8  1129-1140**ZENER SOT23 5V1 0.4W BZX84C5V1  ZENER-DIODESOT23  [SOT23]

## Nets
13.8V+: C18.P$1 C24.P$1 C36.1 C37.1 C40.+ C40.+1(+) C42.+ C72.2 C73.1 C74.1 D7.A L6.1 OC2.1 R50.1 R78.2 R117.1 TRF1.9 TRF1.10 TRF1.21 TRF1.22 TRF1.29 TRF1.30 TRF1.43 TRF1.44
+3V3: C38.1 C39.1 C45.1 C48.1 C49.1 C51.1 C54.1 C55.1 C57.1 D13.2(C) IC4.3(OUT) IC5.8(P:V+) LED1.2 PROG1.1(+3V3) PROG2.1(+3V3) R45.2 R46.1 R72.2 R100.2 R110.2 U1.24(VDD.) U1.36(VDDIO2) U1.48(VDD)
AUX1: D1.A R19.2 R20.2
BOOST_INP: C63.1 R91.1 TP1.TP U1.15(PA5)
CUT_OFF_OUTPUT: C71.1 D14.A R110.1 U1.16(PA6)
DRAIN1: C17.1 C17.3 D4.A Q1.D TRF1.55 TRF1.56 TRF1.57 TRF1.58
FB: C8.1 IC1.2(FB) OC1.4 OC2.4
GATE1: IC8.GATE(G4) R107.1 R116.2 T7.3(C) T9.3(C) Z8.3(C)
GND: B1.- C6.2 C7.2 C8.2 C9.1 C10.- C12.- C13.- C14.2 C15.2 C18.P$2 C29.1 C59.2 C76.2 C82.2 IC1.4(GND) OC1.3 OC2.3 R5.1 R10.1 R118.1 R119.1 TRF1.6 TRF1.14 TRF1.33 TRF1.48 TRF1.49 Z1.1(A)
GNDA: C20.- C22.P$1 C23.2 C26.2 C28.1 C30.1 C31.2 C32.2 C33.1 C34.1 C35.1 C36.2 C37.2 C38.2 C39.2 C40.- C40.-1(-) C41.2 C42.- C43.1 C44.2 C45.2 C47.2 C48.2 C49.2 C51.2 C53.2 C54.2 C55.2 C57.2 C60.1 C61.2 C62.1 C63.2 C64.2 C65.1 C66.2 C67.2 C68.1 C69.1 C70.1 C72.1 C75.2 C78.2 C79.1 C84.- C84_X.- C85.2 C98.1 C110.1 D12.A1 D13.1(A) D18.A H2.1 H2.2 H2.3 H2.4 IC2.5(5.TRIG) IC2.7(7.GND) IC4.1(GND) IC5.4(P:V-) IC6.A IC9.4(P:V-) L2.1(1.GND) L2.4(4.GND) PROG1.3(GND) PROG2.3(GND) Q2.S R25.2 R26.2 R38.2 R39.2 R40.2 R41.2 R42.2 R43.2 R44.2 R47.2 R48.2 R51.2 R56.1 R58.2 R64.1 R65.1 R68.1 R73.2 R75.1 R81.2 R82.2 R87.1 R90.1 R99.1 R102.1 R135.1 T5.2(E) T6.2(E) TRF1.6.1 TRF1.6.2 TRF1.6.5 TRF1.7 TRF1.24 TRF1.27 TRF1.40 TRF1.41 TVS1.A U1.8(VSSA) U1.23(VSS..) U1.35(VSS) U1.47(VSS.) U2.2(GND) X2.GND X2.SHLD1 X2.SHLD2 X4.1 Z4.1(A) Z6.1(A)
GNDIO: D15.C IC8.D1(D5678) IC8.D2(D5678) IC8.D3(D5678) IC8.D(D5678) IC8.P$1(D5678) IC8.P$2(D5678) IC8.P$3(D5678) R57.1 T10.E X3.2
HV1: IC1.8(HV) R12.2
I_FOR_REV_BAT_PROTEC: C50.2 IC5.3(A:+IN) IC5.7(B:OUT) R71.2 R109.2
I_OUT_ADC: C62.2 R83.2 U1.17(PA7)
I_PWM: R55.2 U1.18(PB0)
JTDO: PROG1.6(PRG_SWO) PROG2.6(PRG_SWO) U1.39(PB3)
LED_B: R52.1 U1.41(PB5)
LED_G: R53.1 U1.40(PB4)
LED_R: R49.1 U1.42(PB6)
N$1: TRF1.1 TRF1.2 TRF1.17 TRF1.18 TRF1.36 TRF1.37 TRF1.53 TRF1.54
N$2: R63.1 R64.2
N$3: Q2.G R36.2 R38.1
N$4: R30.2 R33.1 R34.1
N$6: OC2.2 Z5.3(C)
N$7: D14.C R112.2 R113.2 Z7.3(C)
N$8: B1.AC1 C4.2 C83.2 C83.4 L1.4 L1.7
N$9: R91.2 R92.2 R93.2 Z4.3(C)
N$10: R95.1 R99.2 T6.1(B)
N$11: D5.A Q1.G R14.1 R21.2
N$12: R103.2 Z5.1(A)
N$13: IC6.R R89.1 R90.2
N$14: C19.1 R35.1
N$15: C68.2 R103.1 R104.2
N$16: C52.2 C56.2 IC3.7(OUT) R74.1
N$17: D11.A R93.1
N$18: D11.C X4.3
N$19: IC2.8(8.DRV) R36.1
N$20: R59.1 R60.1 T3.C
N$21: C21.2 R25.1 R26.1 R39.1 R40.1 R41.1 R42.1 R43.1
N$22: IC3.4(CV-) R76.2 R79.1 R80.2
N$23: C13.+ C29.2 R8.2 R13.1 T1.4(C) T1_X.3(C)
N$24: C80.1 IC3.2(CC-) R66.1 R70.2
N$25: R94.1 X4.2
N$27: L2.6 R96.1
N$28: D2.C R17.1 R18.1
N$29: F1.2 F1_X1.P$2 F1_X2.P$2 F1_X3.P$2 F1_X4.P$2 F1_X5.P$2 F1_X6.P$1 X1.2
N$30: C16.2 R19.1
N$32: B1.AC2 C5.1 C83.1 C83.3 L1.2 L1.6
N$34: C17.2 C17.4 R31.1
N$35: C46.2 IC3.8(VCC) R69.2
N$36: C50.1 C81.1 IC5.6(B:-IN) R68.2 R71.1
N$37: C81.2 IC5.5(B:+IN) R67.1
N$38: C19.2 D6.A R22.1
N$40: R109.1 T7.1(B)
N$41: C10.+ R16.1 T1.3(E) T1_X.2(E)
N$42: TP4.TP U1.28(PB15)
N$43: IC2.2(2.MIN_TOFF) R48.1
N$44: D5.C R14.2 R15.1
N$45: C56.1 R76.1
N$47: R78.1 R79.2 T4.3(C)
N$48: R81.1 T4.2(E)
N$49: IC1.5(DRV) R15.2
N$51: IC2.3(3.MIN_TON) R47.1
N$52: C60.2 R82.1 R84.2 T4.1(B)
N$53: C58.2 IC5.1(A:OUT) R77.2 R83.1
N$55: R54.1 R59.2 R61.1 T3.E
N$56: LED1.1 R49.2
N$58: C43.2 R60.2 R62.2
N$59: C80.2 IC3.3(CC+) R62.1 R63.2
N$60: R54.2 R55.1 T3.B
N$61: C58.1 IC5.2(A:-IN) R75.2 R77.1
N$62: R104.1 T6.3(C) Z6.3(C)
N$65: D3.C R23.1 R24.1
N$67: R56.2 U1.44(BOOT0)
N$69: C46.1 C71.2 IC3.6(GND) IC8.S1(S123) IC8.S2(S123) IC8.S(S123) R65.2 R66.2 R67.2 R80.1 R114.2 R116.1 T7.2(E) T9.2(E) Z7.1(A) Z8.1(A)
N$70: C77.2 D18.C L5.2 U2.6(LX)
N$72: C77.1 R194.2
N$73: R194.1 U2.1(BS)
N$74: R193.1 U2.4(EN)
N$75: R20.1 TRF1.5 TRF1.15 TRF1.34 TRF1.50
N$76: R31.2 R33.2 R34.2
N$77: R22.2 TRF1.8 TRF1.23 TRF1.28 TRF1.42
N$78: RL1.S0 X3.4
N$79: C1.2 C3.2 C3.4 C3.6 L1.3 L1.8 NTC1.P$1 NTC1.P$4 R1.1 R2.1
N$81: C2.2 C3.1 C3.3 C3.5 F1.1 F1_X1.P$1 F1_X2.P$1 F1_X3.P$1 F1_X4.P$1 F1_X5.P$1 F1_X6.P$2 L1.1 L1.5 R1.2 R4.2
N$82: R112.1 R115.1
N$84: C21.1 IC2.6(6.CS) Q2.D TRF1.11 TRF1.12 TRF1.13 TRF1.19 TRF1.20 TRF1.25 TRF1.31 TRF1.32 TRF1.38 TRF1.45 TRF1.46 TRF1.47
N$85: C84.+ C84_X.+ C85.1 L6.2 X3.1
N$86: R27.2 R30.1
N$87: NTC1.P$2 NTC1.P$3 X1.1
N$88: D15.A R117.2 T10.B
N$90: D4.C R17.2 R18.2 R23.2 R24.2
N$92: C31.1 C32.1 R45.1 U1.9(VDDA)
N$93: R2.2 R3.2
N$94: R3.1 R4.1
N$95: LED1.4 R52.2
N$96: LED1.3 R53.2
N$97: R9.1 R10.2
N$99: R115.2 T10.C
N$101: IC9.6(B:-IN) R101.1 R102.2 R106.1
N$102: D12.A IC9.5(B:+IN) R94.2 R98.1 R105.1
N$103: R113.1 R114.1 T9.1(B)
N$104: IC9.7(B:OUT) R105.2 R106.2 R108.1
N$107: D10.A RL1.1 T5.3(C)
N$108: R86.1 R87.2 T5.1(B)
N$109: L2.5 R97.1
N$110: C65.2 IC6.C IC9.3(A:+IN) R88.1 R89.2
N$111: IC9.1(A:OUT) IC9.2(A:-IN) R98.2 R101.2
N$112: C16.1 D1.C R13.2
N$113: R11.1 R12.1
N$114: C6.1 IC1.1(FAULT) R5.2 Z2.1(A)
N$155: R133.1 R134.2
N$156: L2.3 X2.D-
N$157: L2.2 X2.D+
N$161: C64.1 D9.1(A1) D9.2(A2) R85.1 TVS1.C
N$197: R7.2 R8.1
N$198: R7.1 T1.1(B) T1_X.1(B) Z1.3(C)
N$254: C52.1 R70.1
NRST: C30.2 PROG1.5(NRST) PROG2.5(NRST) R46.2 U1.7(NRST)
OSC1: C23.1 Q3.1 U1.5(PF0/OSC_IN)
OSC2: C26.1 Q3.2 U1.6(PF1/OSC_OUT)
OVER_VOLT: R95.2 U1.38(PA15)
PE: C1.1 C2.1 C4.1 C5.2 C7.1 C11.1 C25.1 C27.1 C35.2 C59.1 C73.2 C74.2 C75.1 X1.3 ; supply symbol labelled EARTH
PRI_SOURCE: C22.P$2 C25.2 H1.1 H1.2 H1.3 H1.4 Q1.S R6.2 R21.1 R27.1 R118.2 R119.2
PT100_ADC: C70.2 D13.3(AC) R108.2 U1.11(PA1)
REG_INP: C47.1 D8.C D9.3(C) IC4.2(IN) IC4.4(IN)
RELAY_OP: R86.2 U1.12(PA2)
RES: C28.2 IC2.4(4.LLD) R44.1
RL+: RL1.P0 RL1.P1 X3.3
SENSE: C9.2 IC1.3(CS) R6.1
SWCLK: PROG1.2(PRG_SWCLK) PROG2.2(PRG_SWCLK) U1.37(PA14)
SWDIO: PROG1.4(PRG_SWDIO) PROG2.4(PRG_SWDIO) U1.34(PA13)
U3-K: OC1.2 R74.2
USB_DM: C66.1 R97.2 U1.32(PA11)
USB_DP: C67.1 R96.2 R100.1 U1.33(PA12)
V_FB2: C78.1 R134.1 R135.2 U2.3(FB)
V_NTC_ADC: C53.1 R72.1 R73.1 U1.10(PA0)
V_PWM: R84.1 U1.19(PB1)
V_SUPPLY: C33.2 C34.2 C61.1 C69.2 C79.2 C98.2 D8.A D10.C IC2.1(1.VCC) IC9.8(P:V+) L5.1 OC1.1 R69.1 R88.2 R92.1 R107.2 R133.2 RL1.2
VAUX_DC: C20.+ C110.2 D6.C D7.C R35.2 R193.2 U2.5(VIN)
VAUX_PRI: C14.1 C15.1 IC1.6(VCC) R16.2 Z2.3(C)
VBAT_ADC: C44.1 R57.2 R58.1 U1.13(PA3)
VBUS1: R85.2 X2.VBUS
VDC_BUS: B1.+ C11.2 C12.+ C24.P$2 C27.2 C76.1 C82.1 D2.A D3.A R9.2 R11.2 TRF1.3 TRF1.16 TRF1.35 TRF1.52
VOUT+_ADC: C41.1 R50.2 R51.1 U1.14(PA4)
VREF2.1: IC3.1(VREF) IC3.5(CV+) R61.2
Unconnected: U1.1(VBAT) U1.2(PC13) U1.3(PC14/OSC32_IN) U1.4(PC15/OSC32_OUT) U1.20(PB2) U1.21(PB10) U1.22(PB11) U1.25(PB12) U1.26(PB13) U1.27(PB14) U1.29(PA8) U1.30(PA9) U1.31(PA10) U1.43(PB7) U1.45(PB8) U1.46(PB9)

## Notes on the sheet
- USB
- MICROCONTROLLER
- BOOST 
  INPUT
- Over voltage protection | Rev. Bat. Protection
- 6K8
- 6K8
- Regulation
- HV 
  Protection

## Library data of the parts
B1 = ENKO2:DıODE_BRIDGE_8A_DIK
C1 C2 C4 C5 C7 C11 C25 C27 C59 = ENKO2:C50-035X75
C3 = ENKO2:C275-113X316_&_C150-072X183_&_C225-113X268
C6 C8 C9 C14-C16 C19 C21 C23 C26 C28-C39 C41 C43-C58 C60-C75 C77-C82 C85 C98 C110 = rcl:C-EU: CAPACITOR, European symbol
C10 C12 C13 C20 C42 C84 C84_X = rcl:CPOL-EU: POLARIZED CAPACITOR, European symbol
C17 = ENKO2:C075-32X103/C050-035X75
C18 C22 C24 = ENKO2:C075-32X103_DEIF
C40 = ENKO2:E5-13/E7,5-16
C76 = ENKO2:C065-052X106
C83 = ENKO2:C150-091X182_C225-108X268
D1 D4 D6 D7 = enko:M7_DC_DIYOT
D2 D3 D5 D8 D10 D11 D14 D15 = diode:DIODE-: DIODE
D9 = diode:DIODE-2AC|CA: Dual DIODE Anode-Cathode|Cathode-Anode
D12 = diode:TRANSIL_SMB
D13 = diode:BAV199: DIODE low-leakage double diode
D18 = diodes:SD-: Schottky diode
F1 = enko:SENS_FUSE
F1_X1 = enko:FUSE_0678D
F1_X2 = enko:FUSE_1025FA
F1_X3 = enko:FUSE_EBF_FUSE_446/447
F1_X4 = enko:FUSE_OMF250
F1_X5 = enko:FUSE_UMF250
F1_X6 = ENKO2:FUSE_TYPE0679H
H1 H2 = ENKO2:DEIF_SOGUTUCU_2
IC1 = enko:NCP1239_SMPS_IC
IC2 = enko:NCP4306
IC3 = mutlu:TSM1011
IC4 = v-reg-3:S-812XSG: Low power, low dropout positive regulator
IC5 IC9 = linear:LM358: OP AMP also LM158; LM258; LM2904 Source: http://cache.national.com/ds/LM/LM158.pdf
IC6 = enko:TL431_SOT23F
IC8 = enko:TPH6R30ANL
L1 = ENKO2:UU1620_&_FWCMET24V
L2 = enko:EXC24CS_COMMON_MODE
L5 = wuerth-elektronik:WE-PD2: SMD-Power Inductors WE-PD2 Is recommended for the application with switching regulators from National Semiconductor, Linear Technology, Texas Instruments and Fairchild Semiconductor -- Switching regulators with low operating voltages (computer, laptop, mobile phones, pagers) -- Integrated DC/DC-converter
L6 = enko:INDUCTOR-NEOSID
LED1 = ENKO2:KPFA-3010RGBC-11
NTC1 = ENKO2:NTC_15R_2A_&_N15SP005-5
OC1 OC2 = enko:PS2561DL2-1_OPTO1
PCB1 STENCIL = BOM:PCB
PROG1 PROG2 = ENKO2:PROG_6PIN
Q1 Q2 = transistor-power:STP5NA50: N-CHANNEL MOS FET
Q3 = crystal:CRYSTAL: CRYSTAL; OC_FARNELL: unknown; OC_NEWARK: unknown
R1 = varistor:S20K40: VARISTOR
R2-R27 R30 R31 R33-R36 R38-R110 R112-R119 R133-R135 R193 R194 = rcl:R-EU_: RESISTOR, European symbol
RL1 = enko:ALD1_AND_ALJ_RELAY
T1 = ENKO2:MJD31*: Complementary Power Transistors
T1_X T4-T7 T9 = transistor-npn:BC848*: NPN Transistor
T3 T10 = transistor:*-PNP-: PNP Transistror
TP1 TP4 = testpad:PTR1: TEST PIN
TRF1 = ENKO2:DEIF_TRF
TVS1 = supressor:TVS-BD-: TVS BI-DIRECTIONAL
U1 = enko:STM32F072CXXX_LQFP48
U2 = enko:AOZ1282CI-1
X1 = con-phoenix-762:GMSTBA3: PHOENIX; MF: FARNELL; MPN: 1757255; OC_FARNELL: 3705183; OC_NEWARK: 71C4162
X2 = ENKO2:USB_B(YATIK)
X3 = con-phoenix-508:MSTBA4: PHOENIX; MF: FARNELL; MPN: 1757268; OC_FARNELL: 3705195; OC_NEWARK: 71C4163
X4 = con-phoenix-508:MSTBA3: PHOENIX; MF: FARNELL; MPN: 1757255; OC_FARNELL: 3705183; OC_NEWARK: 71C4162
XK1 XK3 XK4 = BOM:SOKET
Z1 Z2 Z4-Z8 = diode:ZENER-DIODE: Z-Diode